# Altium schematic sheet [1] TableOfContents.SchDoc: =DocumentName
size A3; Organization: ORGANIZATION; Address1: R. Aprígio Veloso, 882, Universitário; Address2: Campina Grande - PB; Address3: 58429-900; DocumentNumber: 1; Revision: -; SheetNumber: 1; SheetTotal: 9; ENG_DATE: --/--/--; DSN_DATE: --/--/--; CHK_DATE: --/--/--; SCH_SCALE: 1:1
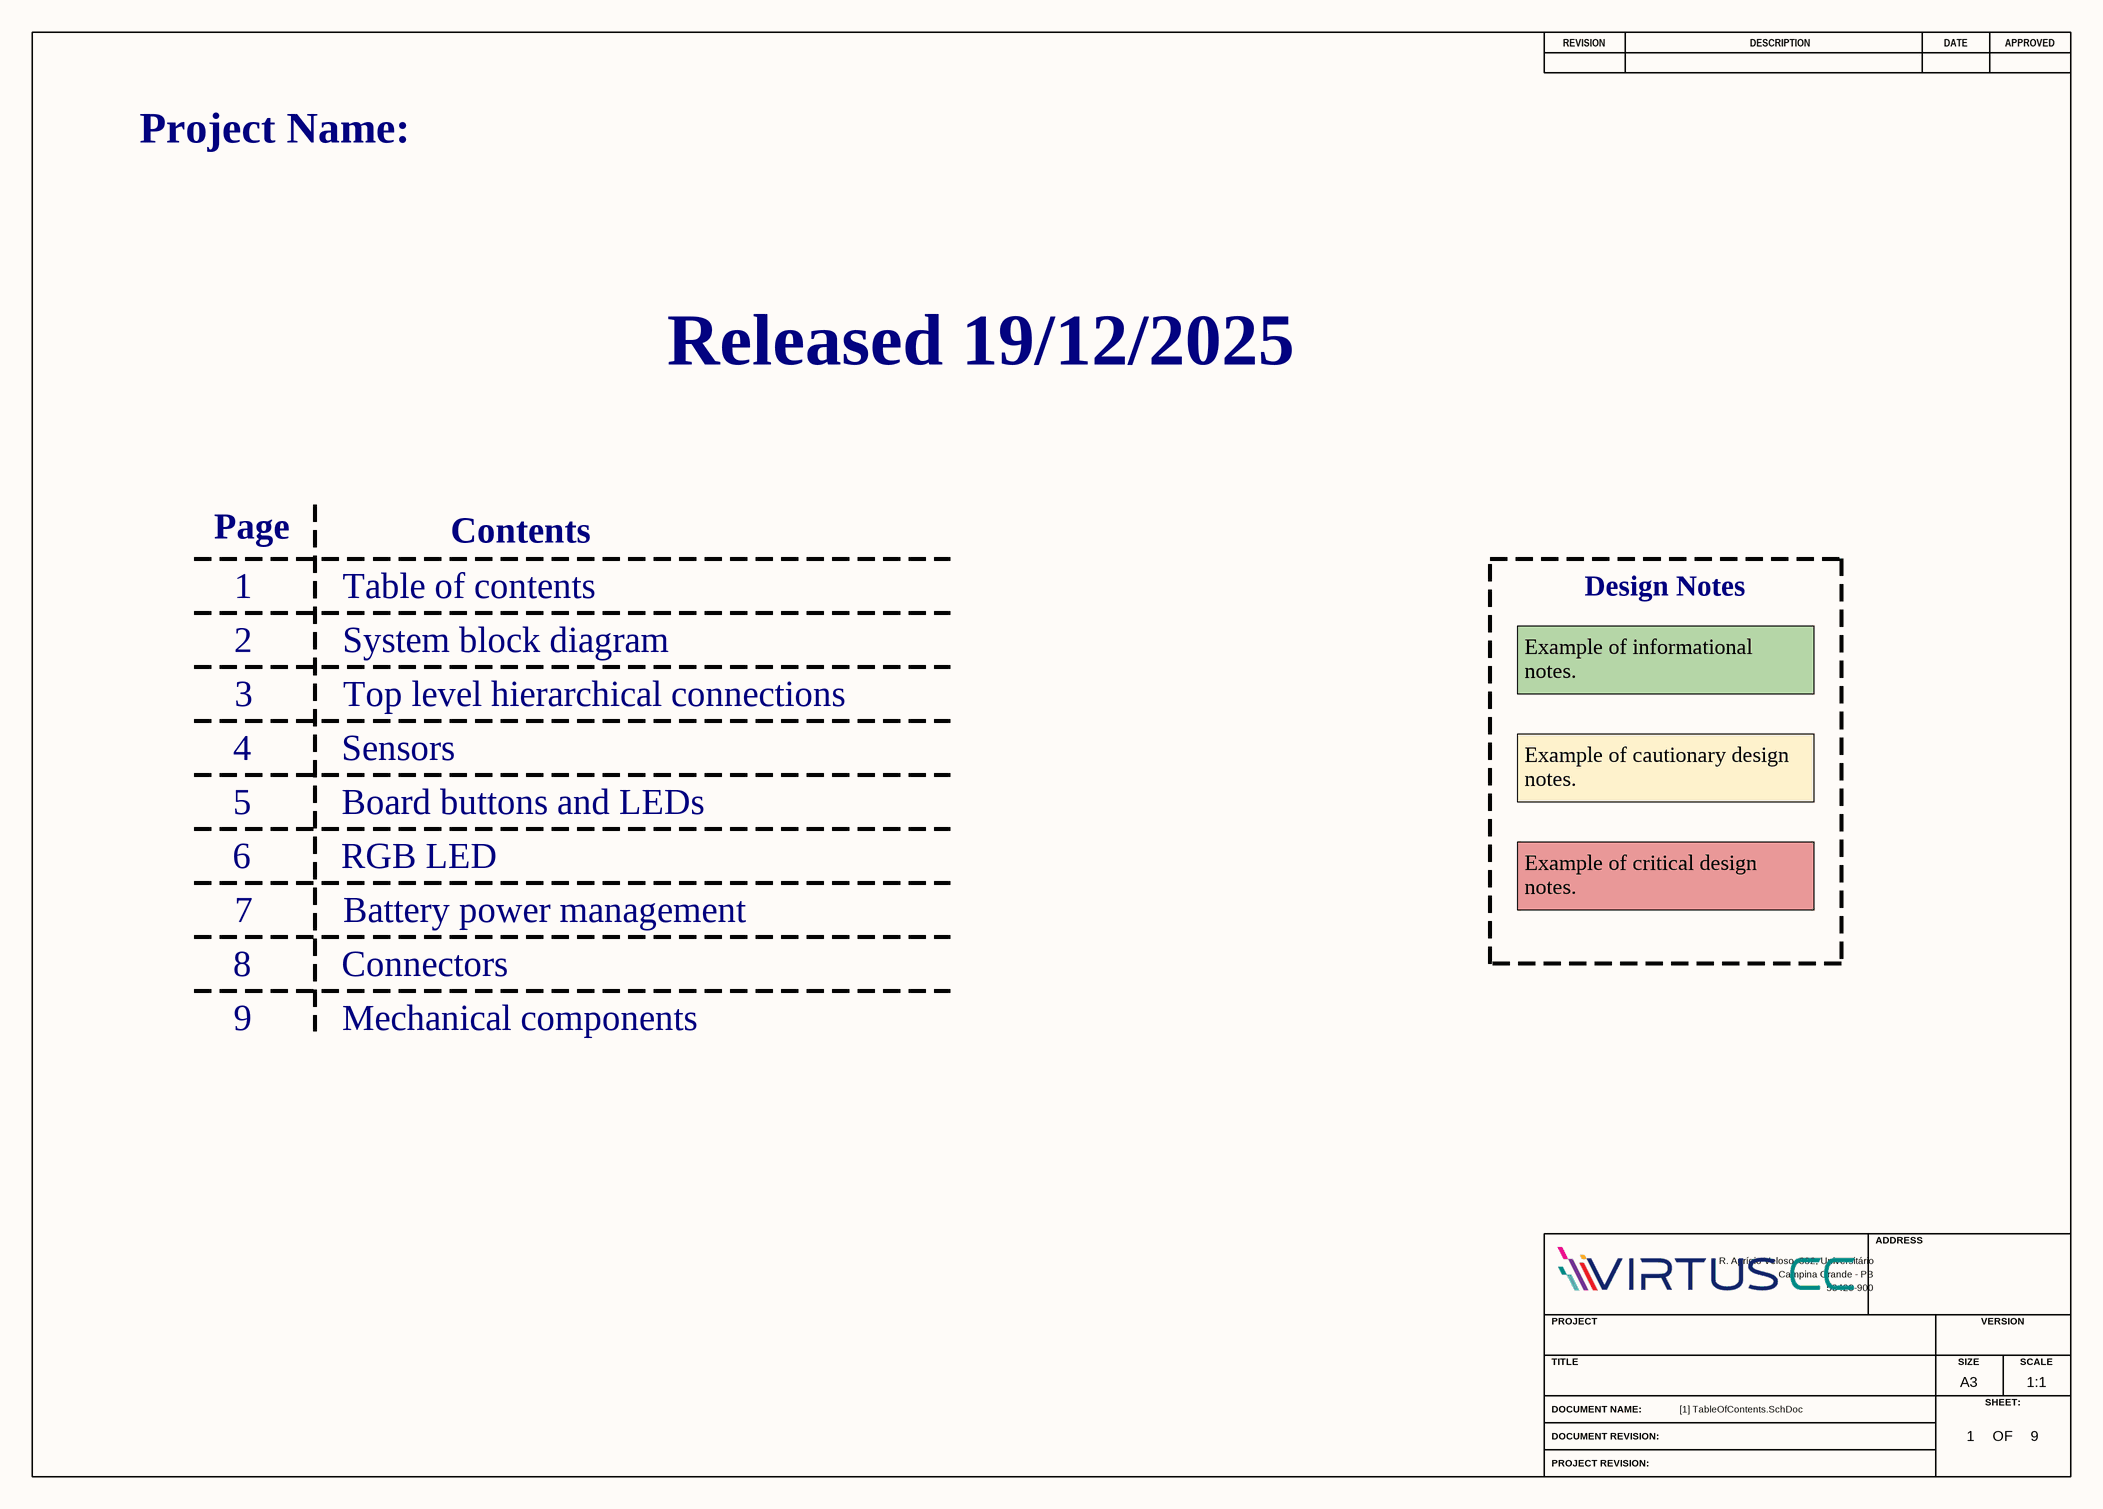
[diagram p0: [1] TableOfContents.SchDoc]

## Notes on the sheet
- Project Name:
- Released 19/12/2025
- Page
- 1          Table of contents
- Contents
- Design Notes
- 2          System block diagram
- 3          Top level hierarchical connections
- Example of informational notes.
- 4          Sensors
- 6          RGB LED
- 5          Board buttons and LEDs
- Example of cautionary design notes.
- 7          Battery power management
- Example of critical design notes.
- 8          Connectors
- 9          Mechanical components
- REVISION
- DESCRIPTION
- DATE
- APPROVED
- ADDRESS
- PROJECT
- VERSION
- TITLE
- A3
- SIZE
- SCALE
- DOCUMENT NAME:
- DOCUMENT REVISION:
- OF
- SHEET:
- PROJECT REVISION: